# EAGLE design MySens-GWeasySensRS485-V01-040 (EAGLE 7.6.0)
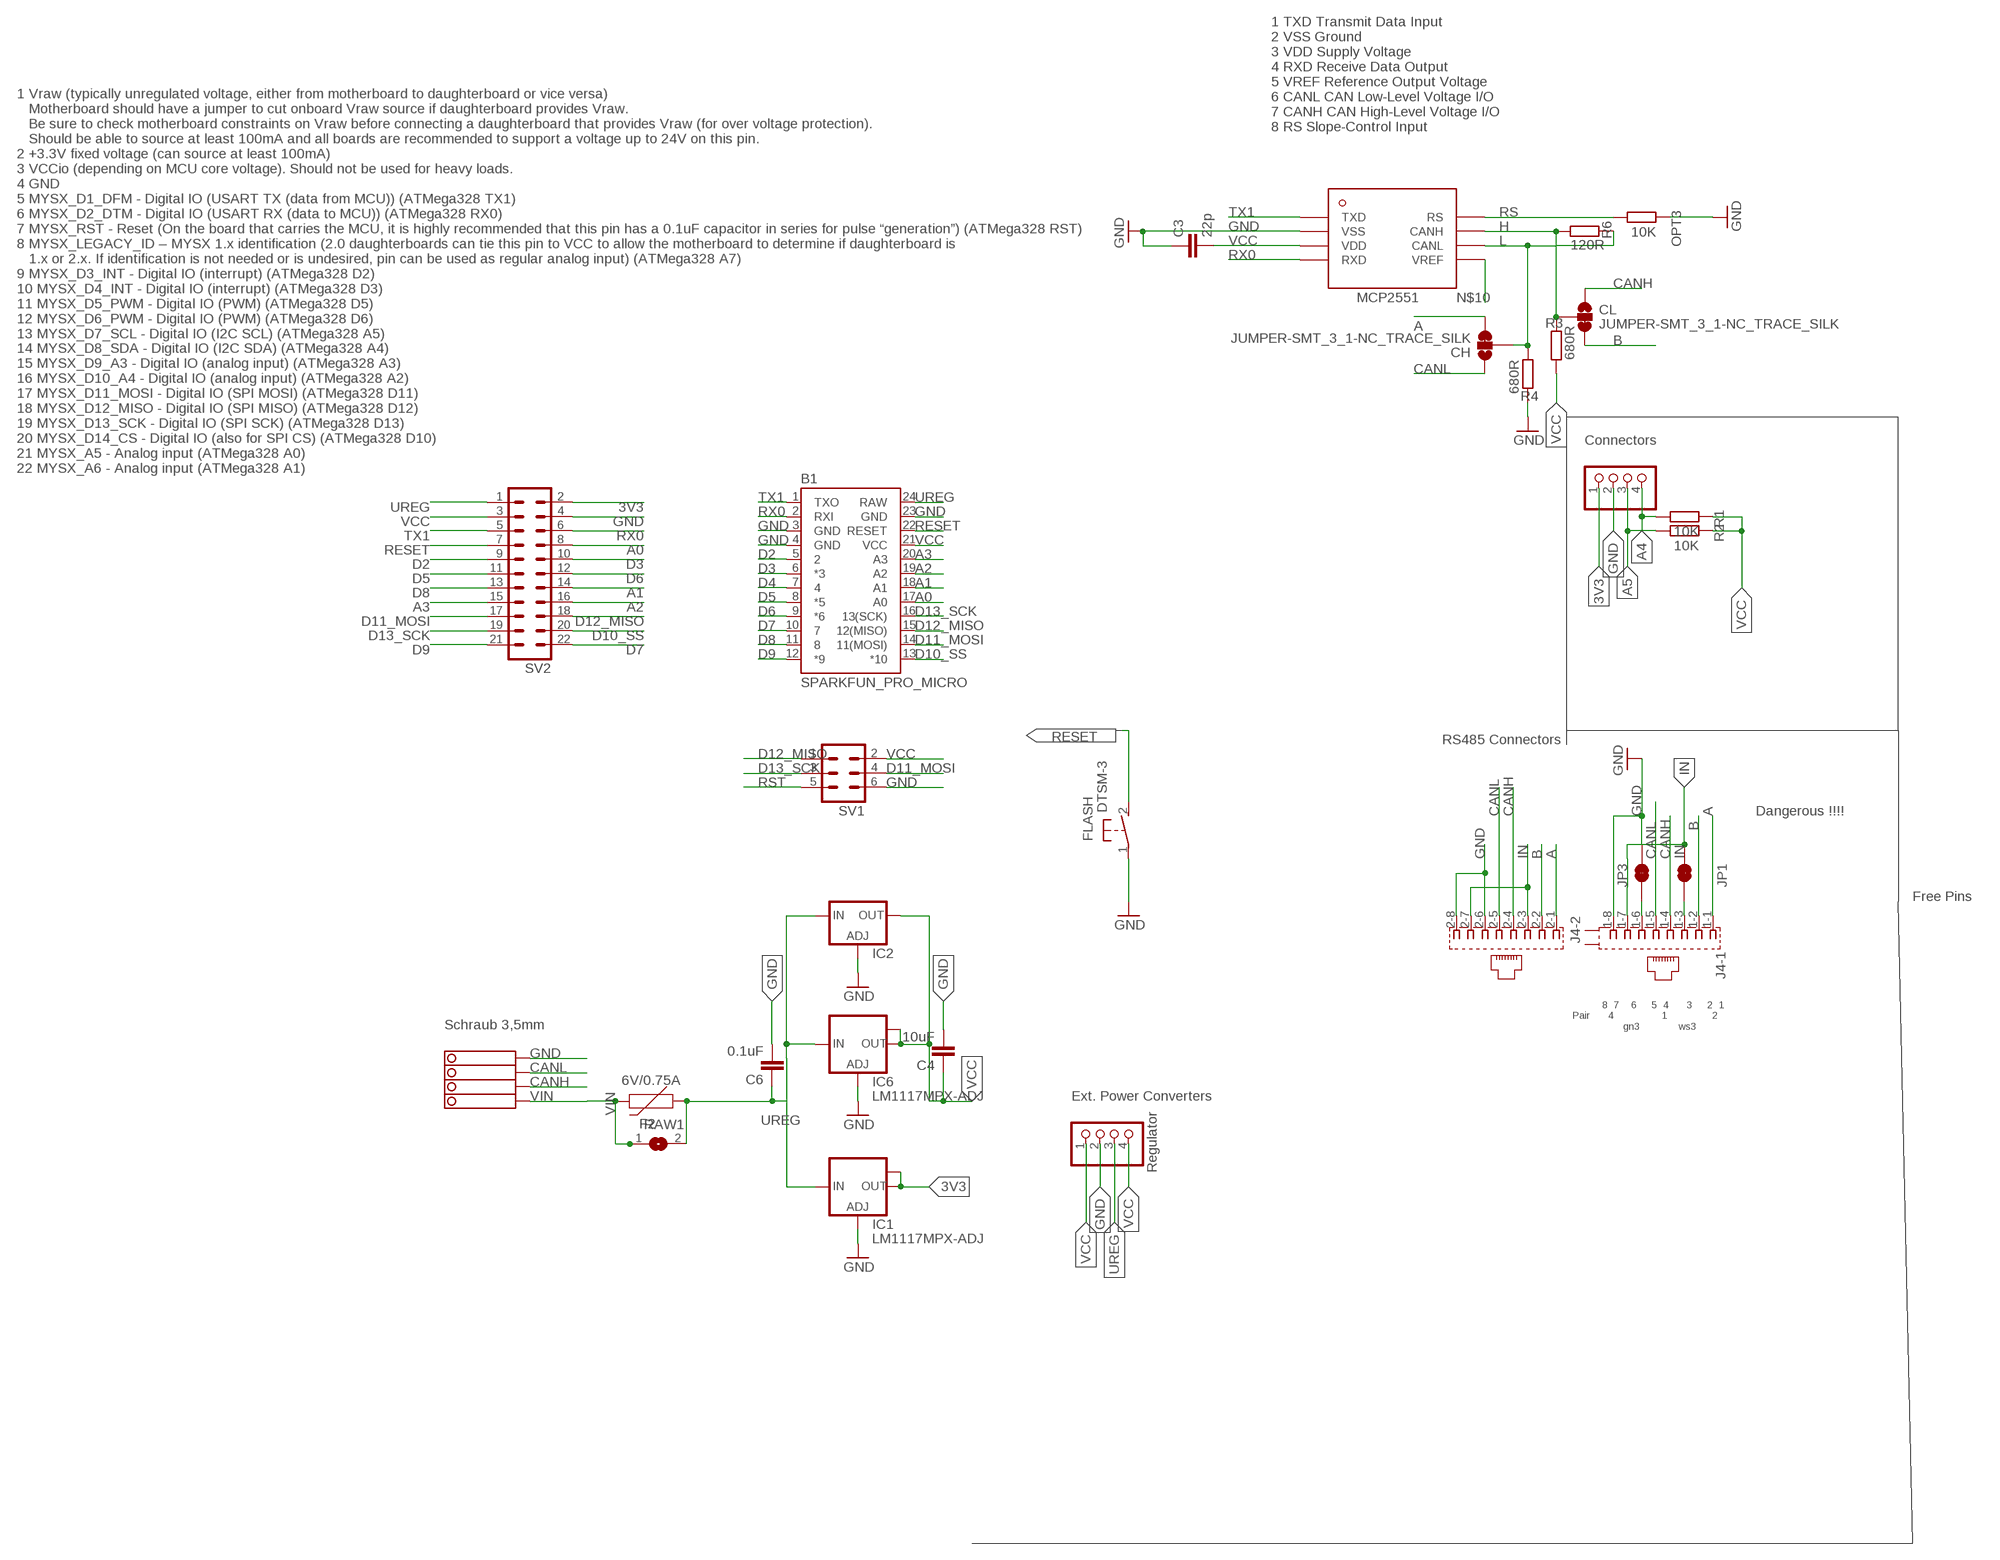
[diagram p0: schematic, sheet 1]

## Parts
B1  SPARKFUN_PRO_MICRO  [SPARKFUN_PRO_MICRO]
C3  22p  C-EUC0805  [C0805]
C4  10uF  C-EUC1210  [C1210]
C6  0.1uF  C-EUC1206  [C1206]
CH  JUMPER-SMT_3_1-NC_TRACE_SILK  [SMT-JUMPER_3_1-NC_TRACE_SILK]
CL  JUMPER-SMT_3_1-NC_TRACE_SILK  [SMT-JUMPER_3_1-NC_TRACE_SILK]
F2  6V/0.75A  PPTC_THREE-QUARTER-AMP  [1206]
FLASH  DTSM-3  [DTSM-3]
I2C  PINHD-1X04_2.54-S  [1X04-S]
IC1  LM1117MPX-ADJ  [SOT223]
IC2  LD117ADT50TR  [DPACK]
IC6  LM1117MPX-ADJ  [SOT223]
J4  RJ45_2X_NARROW_SHILDPINS_NOCASE  [RJ45_2X_NARROW_SHILDPINS_NOCASE]
JP1  JUMPER-SMT_2_NC_TRACE_SILK  [SMT-JUMPER_2_NC_TRACE_SILK]
JP3  JUMPER-SMT_2_NC_TRACE_SILK  [SMT-JUMPER_2_NC_TRACE_SILK]
OPT3  10K  R-EU_R0805  [R0805]
R1  10K  R-EU_R0805  [R0805]
R2  10K  R-EU_R0805  [R0805]
R3  680R  R-EU_R0805  [R0805]
R4  680R  R-EU_R0805  [R0805]
R6  120R  R-EU_R0805  [R0805]
RAW1  SJ  [SJ]
STEPDWN  PINHD-1X04_2.54-S  [1X04-S]
SV1  MA03-2  [MA03-2]
SV2  MA11-2  [MA11-2]
U$1  MCP2551  [SOIC-8]
X4  1751264  [1751264]

## Nets
1: J4.1-3 JP1.1
2: J4.1-6 JP3.1
3V3: I2C.1 IC1.2(OUT) IC1.TAB(OUT1) SV2.2
A: CH.3 J4.1-1 J4.2-1
A0: B1.17(A0) SV2.8
A1: B1.18(A1) SV2.14
A2: B1.19(A2) SV2.16
A3: B1.20(A3) SV2.15
A4: I2C.4 R1.2
A5: I2C.3 R2.2
B: CL.3 J4.1-2 J4.2-2
CANH: CL.1 J4.1-4 J4.2-4 X4.2
CANL: CH.1 J4.1-5 J4.2-5 X4.3
D2: B1.5 SV2.9
D3: B1.6(*3) SV2.10
D4: B1.7
D5: B1.8(*5) SV2.11
D6: B1.9(*6) SV2.12
D7: B1.10 SV2.22
D8: B1.11 SV2.13
D9: B1.12(*9) SV2.21
D10_SS: B1.13(*10) SV2.20
D11_MOSI: B1.14(11(MOSI)) SV1.4 SV2.17
D12_MISO: B1.15(12(MISO)) SV1.1 SV2.18
D13_SCK: B1.16(13(SCK)) SV1.3 SV2.19
GND [Power]: B1.3(GND) B1.4(GND) B1.23(GND) C3.1 C4.2 C6.2 FLASH.1 I2C.2 IC1.1(ADJ) IC2.1(ADJ) IC6.1(ADJ) J4.1-8 J4.2-6 J4.2-8 JP3.2 OPT3.1 R4.2 STEPDWN.2 SV1.6 SV2.4 U$1.VSS X4.4
H: CL.2 R3.2 R6.1 U$1.CANH
IN [Power]: J4.1-7 J4.2-3 J4.2-7 JP1.2
L: CH.2 R4.1 R6.2 U$1.CANL
N$10: U$1.VREF
RESET: B1.22(RESET) FLASH.2 SV2.7
RS: OPT3.2 U$1.RS
RST: SV1.5
RX0: B1.2(RXI) SV2.6 U$1.RXD
TX1: B1.1(TXO) SV2.5 U$1.TXD
UREG [Power]: B1.24(RAW) C6.1 F2.1 IC1.3(IN) IC2.3(IN) IC6.3(IN) RAW1.2 STEPDWN.3 SV2.1
VCC [Power]: B1.21(VCC) C3.2 C4.1 IC2.4(OUT) IC6.2(OUT) IC6.TAB(OUT1) R1.1 R2.1 R3.1 STEPDWN.1 STEPDWN.4 SV1.2 SV2.3 U$1.VDD
VIN [Power]: F2.2 RAW1.1 X4.1
Unconnected: J4.G1(-1:S1) J4.G3(-1:S2)

## Notes on the sheet
- 1 TXD Transmit Data Input 
  2 VSS Ground 
  3 VDD Supply Voltage 
  4 RXD Receive Data Output 
  5 VREF Reference Output Voltage 
  6 CANL CAN Low-Level Voltage I/O 
  7 CANH CAN High-Level Voltage I/O 
  8 RS Slope-Control Input
- Connectors
- 1 Vraw (typically unregulated voltage, either from motherboard to daughterboard or vice versa)
     Motherboard should have a jumper to cut onboard Vraw source if daughterboard provides Vraw. 
     Be sure to check motherboard constraints on Vraw before connecting a daughterboard that provides Vraw (for over voltage protection). 
     Should be able to source at least 100mA and all boards are recommended to support a voltage up to 24V on this pin.
  2 +3.3V fixed voltage (can source at least 100mA)
  3 VCCio (depending on MCU core voltage). Should not be used for heavy loads.
  4 GND
  5 MYSX_D1_DFM - Digital IO (USART TX (data from MCU)) (ATMega328 TX1)
  6 MYSX_D2_DTM - Digital IO (USART RX (data to MCU)) (ATMega328 RX0)
  7 MYSX_RST - Reset (On the board that carries the MCU, it is highly recommended that this pin has a 0.1uF capacitor in series for pulse “generation”) (ATMega328 RST)
  8 MYSX_LEGACY_ID – MYSX 1.x identification (2.0 daughterboards can tie this pin to VCC to allow the motherboard to determine if daughterboard is 
     1.x or 2.x. If identification is not needed or is undesired, pin can be used as regular analog input) (ATMega328 A7)
  9 MYSX_D3_INT - Digital IO (interrupt) (ATMega328 D2)
  10 MYSX_D4_INT - Digital IO (interrupt) (ATMega328 D3)
  11 MYSX_D5_PWM - Digital IO (PWM) (ATMega328 D5)
  12 MYSX_D6_PWM - Digital IO (PWM) (ATMega328 D6)
  13 MYSX_D7_SCL - Digital IO (I2C SCL) (ATMega328 A5)
  14 MYSX_D8_SDA - Digital IO (I2C SDA) (ATMega328 A4)
  15 MYSX_D9_A3 - Digital IO (analog input) (ATMega328 A3)
  16 MYSX_D10_A4 - Digital IO (analog input) (ATMega328 A2)
  17 MYSX_D11_MOSI - Digital IO (SPI MOSI) (ATMega328 D11)
  18 MYSX_D12_MISO - Digital IO (SPI MISO) (ATMega328 D12)
  19 MYSX_D13_SCK - Digital IO (SPI SCK) (ATMega328 D13)
  20 MYSX_D14_CS - Digital IO (also for SPI CS) (ATMega328 D10)
  21 MYSX_A5 - Analog input (ATMega328 A0)
  22 MYSX_A6 - Analog input (ATMega328 A1)
- RS485 Connectors
- Dangerous !!!!
- Free Pins
- Schraub 3,5mm
- 8  7    6     5  4      3     2  1
  Pair      4                1               2
                   gn3             ws3
- Ext. Power Converters
- Regulator

## Library data of the parts
B1 = SparkFun-Boards:SPARKFUN_PRO_MICRO: SparkFun Pro Micro Atmega32U4 compatible footprint. SparkFun Products: 3.3V/8MHz <https://www.sparkfun.com/products/12587> 5V/16MHz <https://www.sparkfun.com/products/12640>
C3 C4 C6 = rcl:C-EU: CAPACITOR, European symbol
CH CL = SparkFun-Jumpers:JUMPER-SMT_3_1-NC_TRACE: Normally closed trace jumper (1 of 2 connections) This jumper has a trace between two pads so it's normally closed (NC). The other connection is normally open (NO). Use a razor knife to open the connection. For best results follow the IPC guidelines for cutting traces: Cutout at least 0.063 mm (0.005 in). Remove all loose material to clean up the cut area. Seal the cut with an approved epoxy. Reapply solder to reclose the connection, or to close the NO connection.
F2 = SparkFun-Fuses:PPTC: Resettable Fuse PPTC Resettable Fuse. Really a sort of resistor with a polymeric positive temperature coefficient whose resistance increases dramatically with an increase in temperature. When heated by the power passing through the resistance rises causing the current to be limited, protecting the circuit. This is achieved by the transition of the polymer from a crystalline to an amorphous state where the conductive carbon separates breaking the conductive pathways found in the cool crystalline structure. When a PPTC cools back down it resumes conducting letting the circuit turn back on. SparkFun Products: SparkFun RedBoard - Programmed with Arduino <https://www.sparkfun.com/products/12757> Pro Micro - 5V/16MHz <https://www.sparkfun.com/products/12640> Arduino Pro 328 - 5V/16MHz <https://www.sparkfun.com/products/10915> MP3 Trigger <https://www.sparkfun.com/products/13720>; PROD_ID: RES-11150
FLASH = mechanics:DTSM-3: Diptronics SMD button 6x3.5 mm
I2C STEPDWN = pinhead-2:PINHD-1X04: PIN HEADER
IC1 IC6 = lm1117:LM1117MPX-ADJ
IC2 = v-reg:LD117A?*: Low drop fixed and adjustable positive voltage regulators 1 A Source: http://www.st.com/stonline/products/literature/ds/7194/ld1117axx.pdf
J4 = RJ45:RJ45_2X_NARROW_SHILDPINS_NOCASE: RJ45 connector
JP1 JP3 = SparkFun-Jumpers:JUMPER-SMT_2_NC_TRACE: Normally closed trace jumper This jumper has a trace between two pads so it's normally closed (NC). Use a razor knife to open the connection. For best results follow the IPC guidelines for cutting traces: Cutout at least 0.063 mm (0.005 in). Remove all loose material to clean up the cut area. Seal the cut with an approved epoxy. Reapply solder to reclose the connection.
OPT3 R1-R4 R6 = rcl:R-EU_: RESISTOR, European symbol
RAW1 = jumper:SJ: SMD solder JUMPER
SV1 = con-lstb:MA03-2: PIN HEADER; OC_FARNELL: unknown; OC_NEWARK: unknown
SV2 = con-Pinheader:MA11-2: PIN HEADER; OC_FARNELL: unknown; OC_NEWARK: unknown
U$1 = MCP2551:MCP2551: The MCP2551 is a high-speed CAN, fault-tolerant device that serves as the interface between a CAN protocol controller and the physical bus. The MCP2551 provides differential transmit and receive capability for the CAN protocol controller and is fully compatible with the ISO-11898 standard, including 24V requirements. It will operate at speeds of up to 1 Mb/s. Typically, each node in a CAN system must have a device to convert the digital signals generated by a CAN controller to signals suitable for transmission over the bus cabling (differential output). It also provides a buffer between the CAN controller and the high-voltage spikes that can be generated on the CAN bus by outside sources (EMI, ESD, electrical transients, etc.).
X4 = con-phoenix-350:1751264: MKDS 1/ 4-3,5 Printklemme Nennstrom: 10 A Bemessungsspannung: 160 V Raster: 3,5 mm Polzahl: 4 Montageart: Löten Anschlussart: Schraubanschluss Anschlussrichtung vom Leiter zur Platine: 0° Source: http://eshop.phoenixcontact.com .. 1751264.pdf; MPN: 1751264; OC_FARNELL: unknown; OC_NEWARK: 10R0934

## Net classes
0 default: width 0.254 mm
1 Power: width 0.508 mm

## Board
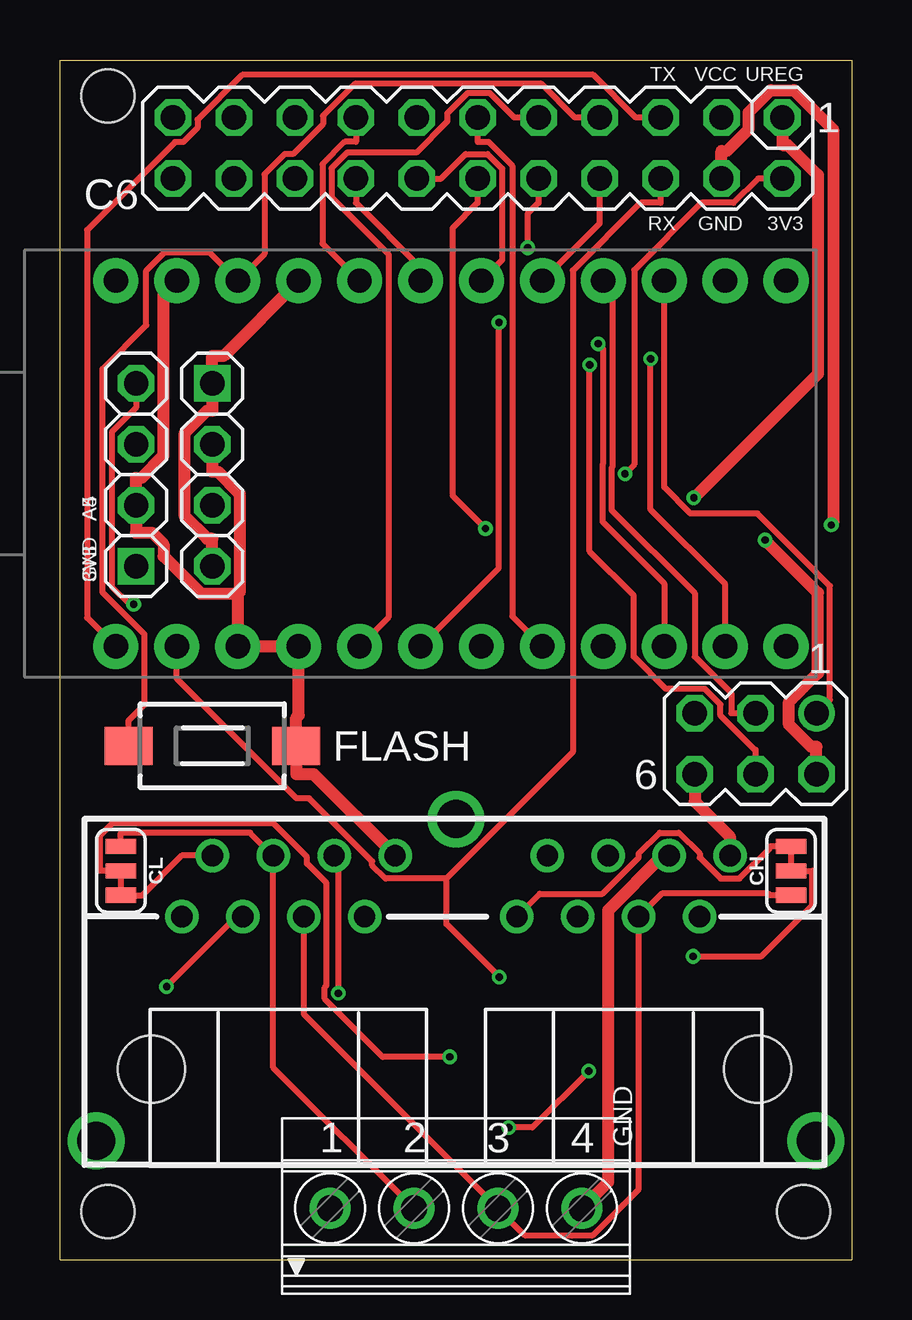
[diagram p1: board, top side]
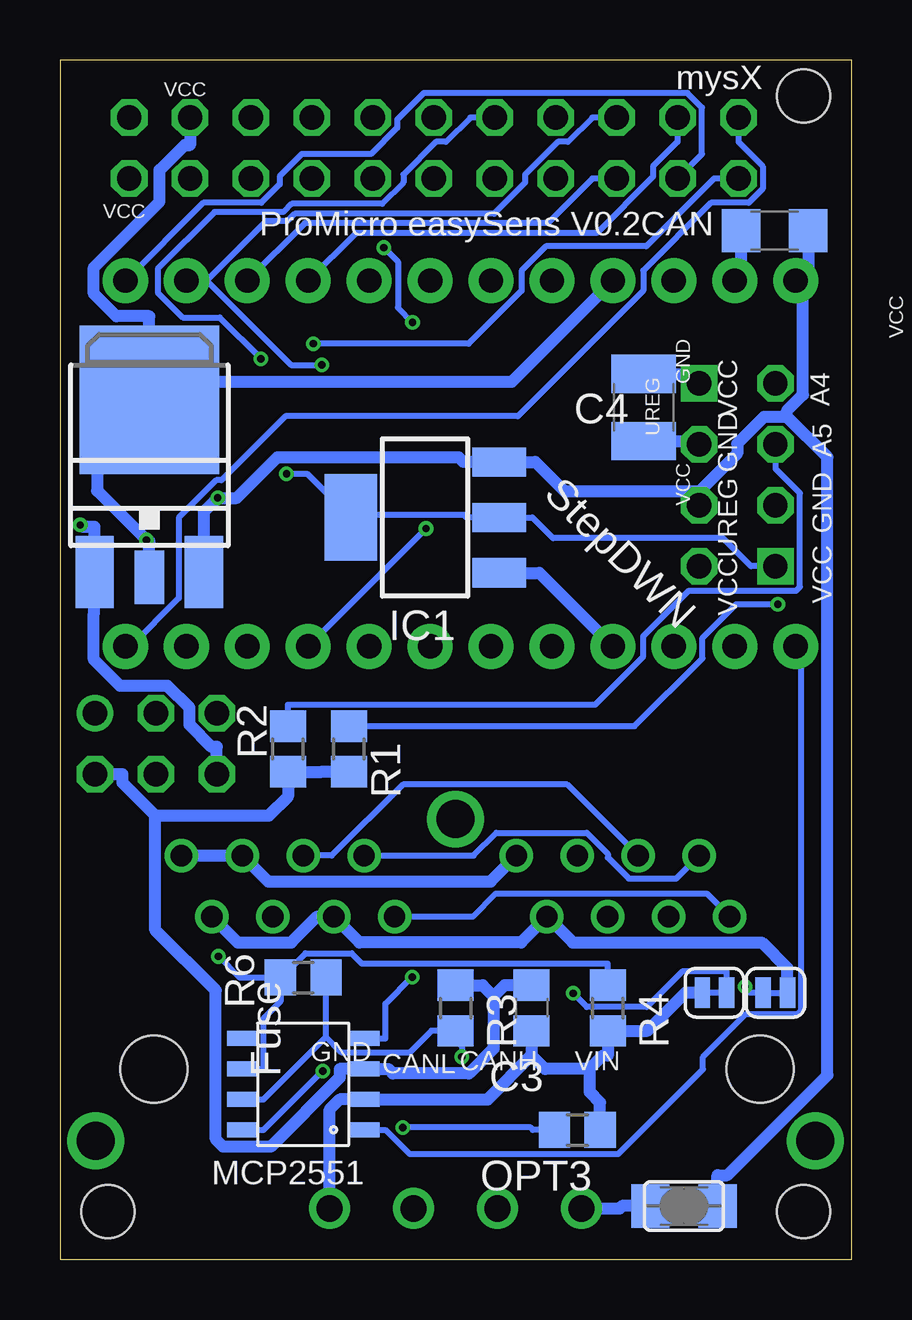
[diagram p2: board, bottom side, seen from below]

Size 33 x 50 mm. Coordinates in mm from the lower left corner, seen from the top.
Outline: 0,0 0,50 33,50 33,0 0,0
Copper layers (1*16): Top 0.035mm / dielectric 1.5mm / Bottom 0.035mm
Design rules "dirt_cheap_dirty_boards.v1": minimum track width 5mil, minimum drill 12mil, track to track 5mil, track to pad 5mil, pad to pad 5mil, via to via 5mil, smd to smd 0mil, copper to edge 10mil, drill to drill 10mil, minimum pad ring 10mil, minimum via ring 6mil, stop-mask expansion 2mil, vias tented up to drill 25mil, thermal gap 10mil
Holes 2.2 mm at 2,48.5 31,2 2,2
tRestrict: area 0,50 to 33,50.5; area 32.8,11.9 to 33.3,44.9; area 0,10.5 to 0.6,43.5
bRestrict: area 0,50 to 33,50.5; area 32.8,12 to 33.3,45

### Footprints (pad centres in the part's own frame; a part is rotated, then mirrored left to right if it is on the bottom)
SPARKFUN_PRO_MICRO = drill 1.016 pad 1.88: 1 -7.62,12.7; 2 -7.62,10.16; 3 -7.62,7.62; 4 -7.62,5.08; 5 -7.62,2.54; 6 -7.62,0; 7 -7.62,-2.54; 8 -7.62,-5.08; 9 -7.62,-7.62; 10 -7.62,-10.16; 11 -7.62,-12.7; 12 -7.62,-15.24; 13 7.62,-15.24; 14 7.62,-12.7; 15 7.62,-10.16; 16 7.62,-7.62; 17 7.62,-5.08; 18 7.62,-2.54; 19 7.62,0; 20 7.62,2.54; 21 7.62,5.08; 22 7.62,7.62; 23 7.62,10.16; 24 7.62,12.7
C0805 = smd 1.3 x 1.5: 1 -0.95,0; 2 0.95,0
C1210 = smd 1.6 x 2.7: 1 -1.4,0; 2 1.4,0
C1206 = smd 1.6 x 1.8: 1 -1.4,0; 2 1.4,0
SMT-JUMPER_3_1-NC_TRACE_SILK = smd 0.635 x 1.27: 1 -1.016,0; 2 0,0; 3 1.016,0
1206 = smd 1.6 x 1.8: 1 -1.4,0; 2 1.4,0
DTSM-3 = smd 2 x 1.6: 1 -3.494,0; 2 3.494,0
1X04-S = drill 1.016 square: 1 -3.81,0 | drill 1.016 octagon: 2 -1.27,0; 3 1.27,0; 4 3.81,0
SOT223 = smd 1.219 x 2.235: 1 -2.311,-3.099; 2 0,-3.099; 3 2.311,-3.099 | smd 3.6 x 2.2: TAB 0,3.099
DPACK = smd 1.6 x 3: 1 -2.28,-4.8; 3 2.28,-4.8 | smd 5.8 x 6.2: 4 0,2.38
RJ45_2X_NARROW_SHILDPINS_NOCASE = drill 0.889: 1-1 -11.43,6.35; 1-2 -10.16,8.89; 1-3 -8.89,6.35; 1-4 -7.62,8.89; 1-5 -6.35,6.35; 1-6 -5.08,8.89; 1-7 -3.81,6.35; 1-8 -2.54,8.89; 2-1 2.54,6.35; 2-2 3.81,8.89; 2-3 5.08,6.35; 2-4 6.35,8.89; 2-5 7.62,6.35; 2-6 8.89,8.89; 2-7 10.16,6.35; 2-8 11.43,8.89 | drill 1.575 pad 2.184: G1 -15,-3; G2 0,10.414; G3 15,-3 | hole 2.8: -12.7,0; 12.573,0
SMT-JUMPER_2_NC_TRACE_SILK = smd 0.635 x 1.27: 1 -0.508,0; 2 0.508,0
R0805 = smd 1.3 x 1.5: 1 -0.95,0; 2 0.95,0
SJ = smd 1.168 x 1.6: 1 -0.762,0; 2 0.762,0
MA03-2 = drill 1.016: 1 -2.54,-1.27 | drill 1.016 octagon: 2 -2.54,1.27; 3 0,-1.27; 4 0,1.27; 5 2.54,-1.27; 6 2.54,1.27
MA11-2 = drill 1.016 octagon: 1 -12.7,-1.27; 2 -12.7,1.27; 3 -10.16,-1.27; 4 -10.16,1.27; 5 -7.62,-1.27; 6 -7.62,1.27; 7 -5.08,-1.27; 8 -5.08,1.27; 9 -2.54,-1.27; 10 -2.54,1.27; 11 0,-1.27; 12 0,1.27; 13 2.54,-1.27; 14 2.54,1.27; 15 5.08,-1.27; 16 5.08,1.27; 17 7.62,-1.27; 18 7.62,1.27; 19 10.16,-1.27; 20 10.16,1.27; 21 12.7,-1.27; 22 12.7,1.27
SOIC-8 = smd 1.27 x 0.635: CANH 2.54,0.635; CANL 2.54,-0.635; RS 2.54,1.905; RXD -2.54,-1.905; TXD -2.54,1.905; VDD -2.54,-0.635; VREF 2.54,-1.905; VSS -2.54,0.635
1751264 = drill 1.1 pad 1.7: 1 -5.25,-0.1; 2 -1.75,-0.1; 3 1.75,-0.1; 4 5.25,-0.1

### Placement (x,y rotation side)
B1  15.03,33.18 90 top
C3  13.34,10.48 90 bottom
C4  8.67,35.52 270 bottom
C6  3.21,42.89 180 bottom
CH  30.48,16.2 90 top
CL  2.54,16.2 270 top
F2  6.99,2.23 180 bottom
FLASH  6.35,21.41 180 top
I2C  3.17,32.71 90 top
IC1  17.78,30.93 90 bottom
IC2  29.27,33.46 0 bottom
IC6  29.27,31.54 0 bottom
J4  16.51,7.95 0 top
JP1  3.17,11.12 0 bottom
JP3  5.71,11.12 180 bottom
OPT3  11.43,5.41 180 bottom
R1  20.95,21.28 90 bottom
R2  23.5,21.28 90 bottom
R3  16.51,10.48 270 bottom
R4  10.16,10.48 270 bottom
R6  22.86,11.76 180 bottom
RAW1  6.99,2.23 0 bottom
STEPDWN  6.35,32.71 270 top
SV1  29,21.5 180 top
SV2  17.41,46.33 180 top
U$1  22.86,7.31 180 bottom
X4  16.51,2.23 0 top

### Tracks (layer width: path | path; a pad name or v marks a point on that pad's centre or on a via)
1  (via drill 0.3 pad 0.61)
  Top 0.254: v4.45,11.38 7.36,14.29 J4.1-3
  Bottom 0.254: JP1.1 4.25,11.12 4.25,11.19 v4.45,11.38
2  (via drill 0.3 pad 0.61)
  Top 0.254: J4.1-6 11.6,16.66 v11.6,11.1
  Bottom 0.254: v11.6,11.1 11.03,10.53 8.53,10.53 7.05,12.01 5.21,12.01 JP3.1
3V3  (via drill 0.3 pad 0.61)
  Top 0.254: SV2.2 29.1,45.06 28.08,44.04 26.74,44.04 23.94,41.25 23.94,33.14 v23.56,32.75
  Bottom 0.254: v23.56,32.75 22.7,32.75 IC1.TAB 20.78,31.03 16.15,31.03 16.05,30.93 IC1.2 13.31,30.93 12.45,30.07 5.36,30.07 4.19,28.9 I2C.1
A
  Top 0.254: CH.3 29.59,17.22 29.59,17.14 28.33,15.88 27.55,15.88 26.67,16.76 26.67,16.92 25.8,17.79 25,17.79 24.13,16.92 24.13,16.76 22.62,15.25 20,15.25 J4.2-1
  Bottom 0.254: J4.2-1 15.79,14.29 14.83,15.25 6.04,15.25 J4.1-1
A0
  Top 0.254: SV2.8 22.5,43.19 B1.17
A1
  Top 0.254: SV2.14 15.89,45.06 16.91,46.08 17.83,46.08 18.43,45.48 18.43,41.66 B1.18
A2
  Top 0.254: SV2.16 12.34,44.04 15.03,41.35 B1.19
A3
  Top 0.254: SV2.15 12.34,46.58 11.88,46.58 10.94,45.65 10.94,42.35 B1.20
A4  (via drill 0.3 pad 0.61)
  Top 0.254: v3.07,27.31 2.88,27.31 2.16,28.03 2.16,34.49 3.17,35.5 I2C.4
  Bottom 0.254: R1.2 9.05,22.23 6.22,25.06 6.22,25.91 4.81,27.31 v3.07,27.31
A5
  Bottom 0.254: I2C.3 3.17,32.96 2.15,31.94 2.15,28.03 2.3,27.88 6.78,27.88 8.68,25.98 8.68,25.14 10.68,23.13 23.5,23.13 R2.2
B
  Top 0.254: CL.3 3.43,15.18 5.08,16.84 J4.1-2
  Bottom 0.254: J4.2-2 15.76,16.84 14.81,17.79 11.03,17.79 10.16,16.91 10.16,16.76 9.28,15.88 7.3,15.88 J4.1-2
CANH
  Top 0.254: X4.2 8.89,8 J4.1-4 7.94,17.79 2.54,17.79 CL.1
  Bottom 0.254: J4.1-4 11.85,19.79 18.71,19.79 21.67,16.84 J4.2-4
CANL
  Top 0.254: J4.1-5 10.16,10.23 X4.3 19.37,1.02 22.22,1.02 24.13,2.93 J4.2-5 25.09,15.25 29.52,15.25 29.59,15.18 CH.1
D2
  Top 0.254: SV2.9 18.94,47.6 17.92,48.62 16.99,48.62 16.14,47.77 16.14,47.43 14.86,46.14 11.97,46.14 11.32,45.49 11.32,44.28 13.69,41.91 13.69,26.76 B1.5
D3  (via drill 0.3 pad 0.61)
  Top 0.254: B1.6 18.3,28.83 v18.3,39.06 | SV2.10 19.95,44.04 19.5,43.59 v19.5,42.18
  Bottom 0.254: v19.5,42.18 18.92,41.6 18.92,39.68 v18.3,39.06
D5
  Top 0.254: SV2.11 17.41,46.58 17.87,46.58 18.86,45.59 18.86,26.81 B1.8
D6  (via drill 0.3 pad 0.61)
  Top 0.254: v17.74,30.47 16.37,31.84 16.37,43 17.41,44.04 SV2.12
  Bottom 0.254: B1.9 v17.74,30.47
D7  (via drill 0.3 pad 0.61)
  Top 0.254: v22.44,38.17 22.64,37.97 22.64,33.18 22.61,33.16 22.61,30.76 25.19,28.18 B1.10
  Bottom 0.254: SV2.22 5.73,45.06 8.55,42.24 12.74,42.24 13.76,41.22 13.76,40.38 15.97,38.17 v22.44,38.17
D8  (via drill 0.3 pad 0.61)
  Top 0.254: B1.11 27.73,28.15 24.62,31.26 v24.62,37.55
  Bottom 0.254: v24.62,37.55 26.34,39.26 27.88,39.26 28.92,40.3 28.92,41.3 26.56,43.66 23.68,43.66 23.34,44 19.57,44 18.68,44.89 18.68,45.23 17.33,46.58 16.91,46.58 15.89,47.6 SV2.13
D9
  Bottom 0.254: SV2.21 4.71,46.58 3.7,45.57 3.7,44.63 4.29,44.04 5.86,44.04 8.68,41.22 8.68,40.38 13.91,35.15 23.6,35.15 26.27,32.48 26.49,32.48 28.05,30.92 28.05,27.57 30.05,25.56 B1.12
D10_SS
  Bottom 0.254: SV2.20 6.24,46.08 6.24,48.02 6.84,48.62 17.84,48.62 18.94,47.51 18.94,47.17 20.04,46.08 22.92,46.08 23.84,45.16 23.84,44.82 24.61,44.04 27.03,44.04 B1.13
D11_MOSI  (via drill 0.3 pad 0.61)
  Top 0.254: v22.08,37.29 22.08,29.51 23.92,27.68 23.92,25.14 25.27,23.79 26.88,23.79 27.54,23.13 27.54,22.68 28.97,21.25 29,21.25 SV1.4
  Bottom 0.254: 26.88,40.8 24.4,43.28 23.52,43.28 23.22,43.59 14.9,43.59 13.61,44.89 13.61,45.23 12.25,46.58 11.83,46.58 10.81,47.6 SV2.17 | 26.88,40.8 23.37,37.29 v22.08,37.29 | B1.14 26.88,40.8
D12_MISO
  Top 0.254: SV1.1 32.1,23.33 32.1,28.07 29.08,31.1 26.28,31.1 25.19,32.19 B1.15
  Bottom 0.254: SV2.18 10.81,45.06 12.66,43.21 22.78,43.21 B1.15
D13_SCK
  Top 0.254: B1.16 23.02,40.42 23.02,33.03 23,33 23,31.24 26.46,27.78 26.46,25.14 27.98,23.61 27.98,22.77 SV1.3
  Bottom 0.254: SV2.19 7.25,46.58 8.27,45.57 8.27,45.14 10.62,42.79 20.66,42.79 B1.16
GND  (via drill 0.3 pad 0.61)
  Top 0.508: J4.1-8 10.58,20.23 9.84,20.23 FLASH.1 9.84,22.59 9.95,22.69 B1.4 B1.3 7.41,27.75 | X4.4 22.86,3.23 22.86,14.56 25.14,16.84 J4.2-6 | J4.2-6 | SV1.6 26.46,19.09 27.94,17.61 J4.2-8 | SV2.4 27.57,46.2 27.8,46.2 28.72,47.12 28.72,47.82 29.64,48.74 30.59,48.74 32.23,47.1 32.23,30.7 v32.15,30.62 | STEPDWN.2 6.35,32.84 6.57,32.84 7.49,31.92 7.49,27.84 7.41,27.75 | B1.23 4.32,40.25 4.32,33.5 3.4,32.58 3.17,32.58 I2C.2 3.17,30.3 3.84,30.3 4.32,29.82 4.32,29.31 5.88,27.75 7.41,27.75
  Bottom 0.508: SV1.6 26.46,21.37 26.68,21.37 27.6,22.29 27.6,22.99 28.52,23.91 30.5,23.91 31.59,25.01 31.59,26.93 31.58,26.94 IC6.1 31.55,28.47 IC2.1 31.55,30.54 32.07,30.54 v32.15,30.62 | X4.4 21.76,6.25 21.34,6.67 U$1.VSS 19.3,6.67 15.16,6.67 13.34,8.5 | 10.93,7.94 12.77,7.94 13.34,8.5 | 10.93,7.94 10.93,6.98 10.48,6.54 OPT3.1 | 10.93,7.94 10.36,8.5 10.16,8.5 R4.2 8.51,9.54 6.92,11.12 JP3.2 | C3.1 13.34,8.5 | C6.2 4.61,41.6 4.87,41.34 B1.23 | C4.2 6.94,34.11 6.8,33.98 STEPDWN.2 | IC1.1 13.01,28.62 B1.4 | J4.2-8 J4.2-6 24.32,15.76 15.05,15.76 J4.1-8
H  (via drill 0.3 pad 0.61)
  Top 0.254: v16.25,8.45 13.46,8.45 11.04,10.87 11.04,11.34 11.11,11.42 11.11,15.69 10.29,16.51 10.29,16.78 8.91,18.17 2.17,18.17 1.65,17.65 1.65,16.2 CL.2
  Bottom 0.254: 16.92,9.54 16.25,8.87 v16.25,8.45 | 16.92,9.54 17.51,9.54 18.41,8.64 21.28,8.64 21.91,9.28 | R3.2 16.92,9.54 | 21.91,9.28 R6.1 | 21.91,9.28 24.51,6.67 U$1.CANH
IN
  Bottom 0.508: J4.2-7 25.59,13.21 23.36,13.21 22.27,14.29 J4.2-3 20.51,13.21 13.78,13.21 J4.1-7 11.62,13.21 3.75,13.21 2.67,12.14 JP1.2
L  (via drill 0.3 pad 0.61)
  Top 0.254: CH.2 31.37,16.2 31.37,14.76 29.25,12.64 v26.39,12.64
  Bottom 0.254: 23.81,11.75 25.5,11.75 v26.39,12.64 | 23.81,11.75 23.81,11.72 | R6.2 23.81,11.75 | 23.81,11.72 22.77,12.76 20.84,12.76 20.42,12.34 10.16,12.34 R4.1 | 23.81,11.72 23.81,11.5 23.81,11.25 23.81,10.75 24.51,10.05 24.51,7.95 U$1.CANL
RESET
  Top 0.254: FLASH.2 2.86,22.46 3.52,23.13 3.52,26.05 1.77,27.8 1.77,37.12 3.6,38.94 3.6,41.22 4.38,42 6.21,42 B1.22 8.53,41.91 8.53,45.23 9.37,46.08 9.71,46.08 10.96,47.33 10.96,47.67 12.3,49 20.08,49 21.48,47.6 SV2.7
RS  (via drill 0.3 pad 0.61)
  Top 0.254: v22.04,7.85 19.7,5.5 v18.71,5.5
  Bottom 0.254: v22.04,7.85 22.07,7.85 24.51,5.41 U$1.RS | v18.71,5.5 13.38,5.5 13.28,5.41 OPT3.2
RX0  (via drill 0.3 pad 0.61)
  Top 0.254: v18.31,11.78 16.11,13.98 16.11,15.88 | 16.11,15.88 13.57,15.88 13.02,16.43 13.02,16.6 10.39,19.23 9.86,19.23 4.87,24.22 B1.2 | 16.11,15.88 21.38,21.15 21.38,41.22 24.2,44.04 25.04,44.04 SV2.6
  Bottom 0.254: v18.31,11.78 19.43,10.66 19.43,9.21 U$1.RXD
TX1
  Top 0.254: SV2.5 24.02,47.6 22.24,49.38 7.6,49.38 5.73,47.52 5.73,47.17 5.14,46.58 4.8,46.58 1.13,42.92 1.13,26.76 B1.1
  Bottom 0.254: U$1.TXD 19.43,5.41 18.43,4.4 9.72,4.4 6.19,7.93 6.19,8.45 4.4,10.23 2.24,10.23 2.09,10.38 2.09,25.32 B1.1
UREG  (via drill 0.3 pad 0.61)
  Top 0.508: SV2.1 30.11,46.46 30.34,46.46 31.59,45.2 31.59,36.92 v26.42,31.75
  Bottom 0.508: IC6.3 26.96,28.62 IC2.3 26.99,31.18 v26.42,31.75 25.63,31.75 23.93,33.44 16.38,33.44 16.18,33.24 IC1.3 13.18,33.24 11.95,32.01 6.35,32.01 | 2.69,35.12 1.01,33.44 1.01,7.68 5.18,3.51 5.58,3.51 F2.1 RAW1.2 | 2.69,35.12 3.65,35.12 4.76,34.01 4.76,33.6 6.35,32.01 | 2.69,35.12 2.69,35.39 2.03,36.05 2.03,40.5 B1.24 1.81,41.32 C6.1 | STEPDWN.3 6.35,32.01
VCC  (via drill 0.3 pad 0.61)
  Top 0.508: B1.21 6.81,37.66 6.35,37.66 STEPDWN.1 6.35,35.38 6.13,35.38 5.21,34.46 5.21,30.96 6.13,30.04 6.35,30.04 STEPDWN.4 | SV1.2 31.54,21.37 31.32,21.37 30.39,22.3 30.39,23.24 31.6,24.44 31.6,27.79 v29.39,29.99
  Bottom 0.508: 29.02,18.5 29.02,13.73 26.51,11.21 26.51,5.02 26.2,4.71 24.21,4.71 21.34,7.58 21.34,7.95 U$1.VDD 20.23,7.95 19.3,7.95 19.12,7.76 15.96,7.76 14.92,8.79 14.92,10.98 | SV1.2 30.4,20.23 30.4,19.88 29.02,18.5 | 29.02,18.5 24.29,18.5 23.5,19.3 R2.1 22.09,20.33 R1.1 | 14.92,10.98 15.38,11.43 R3.1 | 14.92,10.98 14.47,11.43 C3.2 | 29.27,36.59 14.16,36.59 B1.21 | 29.27,36.59 29.27,39.32 30.66,39.32 31.59,40.25 31.59,41.35 28.84,44.1 28.84,45.41 27.8,46.46 27.57,46.46 SV2.3 | 29.27,36.59 IC2.4 IC6.TAB 31.45,34.63 31.45,32.05 v29.39,29.99 29.34,29.93 29.27,29.93 IC6.2 | C4.1 6.94,36.91 6.54,36.52 STEPDWN.1
VIN
  Bottom 0.508: RAW1.1 F2.2 9.57,2.23 9.67,2.13 X4.1

### Text on the board
tNames: TX | VCC | UREG | C6 | RX | GND | 3V3 | A4 | A5 | 3V3 | GND | GND
bNames: mysX | VCC | VCC | ProMicro easySens V0.2CAN | VCC | VCC | GND | A4 | GND | A5 | UREG | GND | UREG | VCC | StepDWN | VCC | VCC | Fuse | GND | VIN | CANH | CANL